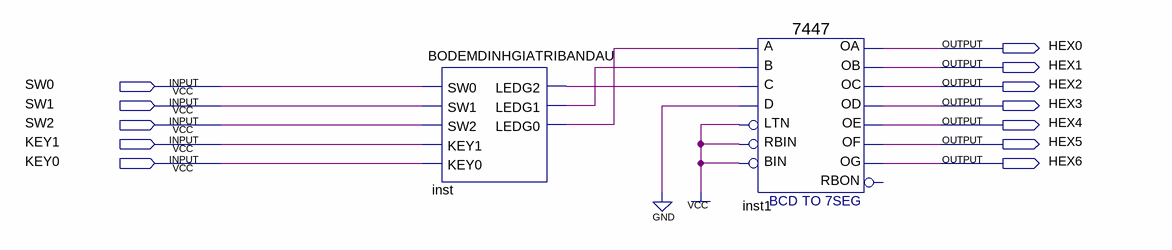
[diagram p0: schematic sheet]
// Quartus schematic BCD.bdf as structural Verilog: 2 symbols, 12 pins
module BCD (
  input  SW0,
  input  SW1,
  input  SW2,
  input  KEY1,
  input  KEY0,
  output HEX0,
  output HEX1,
  output HEX2,
  output HEX3,
  output HEX4,
  output HEX5,
  output HEX6
);

  wire inst_ledg0, inst_ledg1, inst_ledg2;

  BODEMDINHGIATRIBANDAU inst (
    .SW0(SW0), .SW1(SW1), .SW2(SW2), .KEY1(KEY1), .KEY0(KEY0), .LEDG2(inst_ledg2), .LEDG1(inst_ledg1),
    .LEDG0(inst_ledg0));
  \7447  inst1 (
    .LTN(1'b1), .B(inst_ledg1), .C(inst_ledg2), .D(1'b0), .RBIN(1'b1), .BIN(1'b1), .A(inst_ledg0), .OB(HEX1),
    .OC(HEX2), .OE(HEX4), .OD(HEX3), .OF(HEX5), .OG(HEX6), .OA(HEX0));  // open: RBON
endmodule
